# Altium project rtm-damp-dvb.PrjPcb (part 2 of 2)

## Sheet rtm-damp-dvb-clock-and-supply.SchDoc
size A4
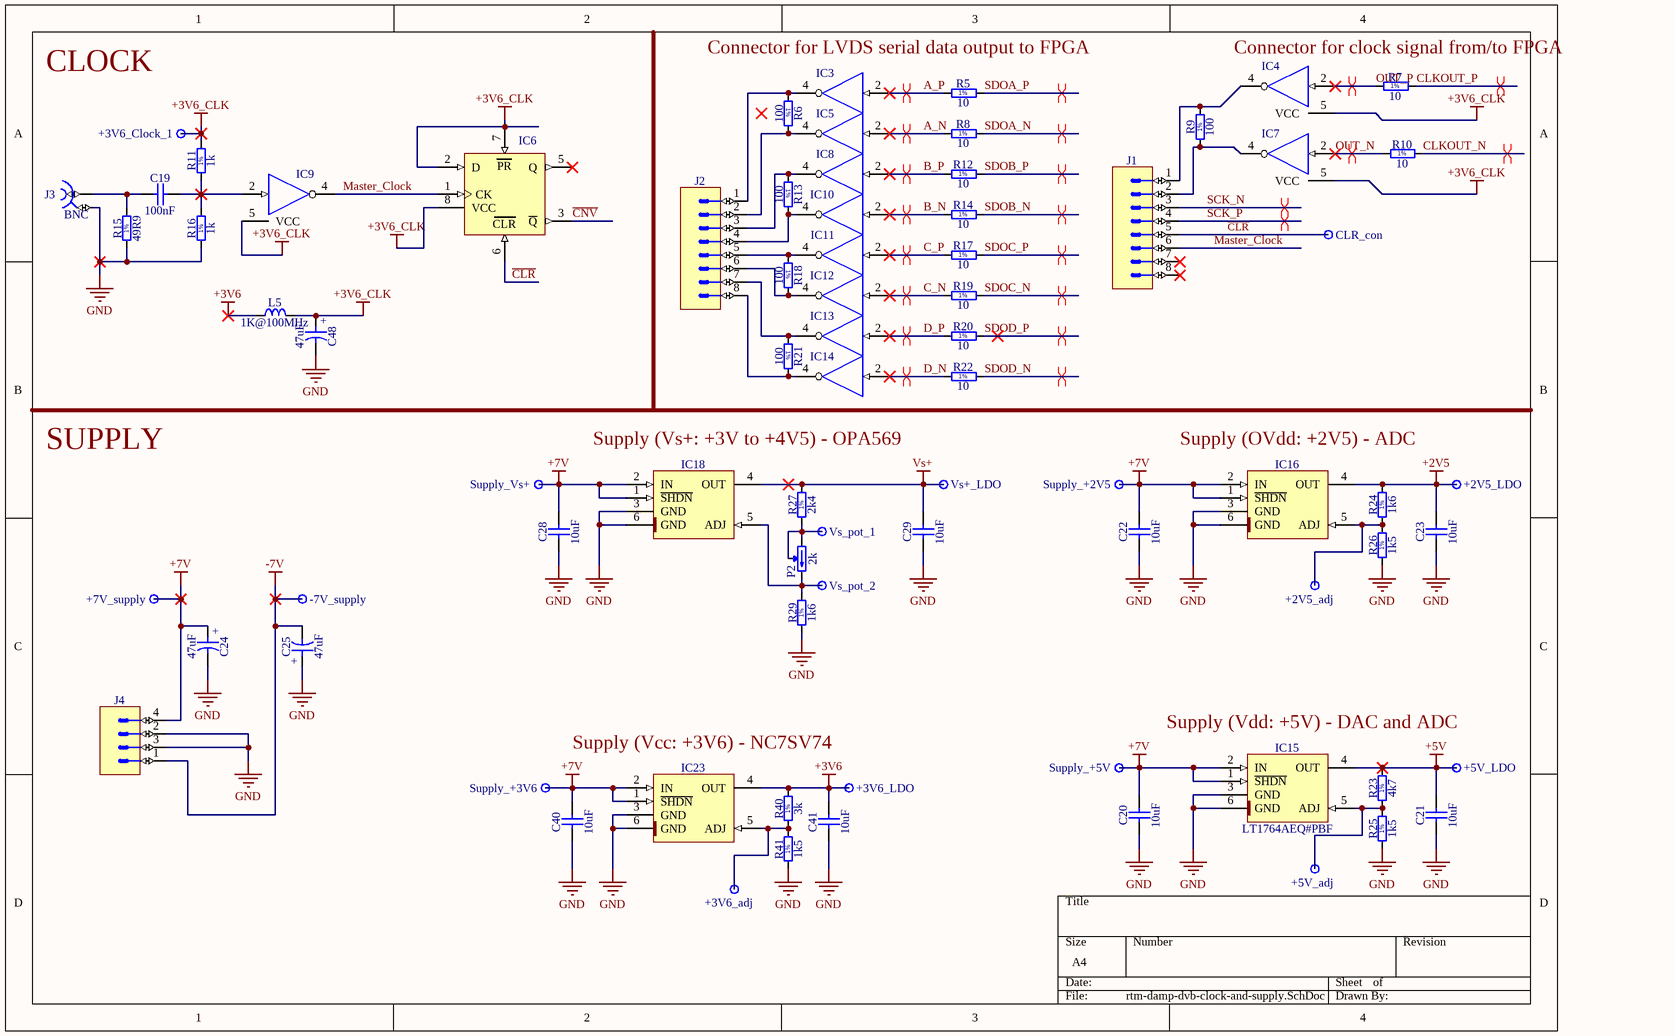
[diagram p2: rtm-damp-dvb-clock-and-supply.SchDoc]

### Parts
+2V5_adj  Test Point  [TPS127]  (value not drawn)
+2V5_LDO  Test Point  [TPS127]  (value not drawn)
+3V6_adj  Test Point  [TPS127]  (value not drawn)
+3V6_Clock_1  Test Point  [TPS127]  (value not drawn)
+3V6_LDO  Test Point  [TPS127]  (value not drawn)
+5V_adj  Test Point  [TPS127]  (value not drawn)
+5V_LDO  Test Point  [TPS127]  (value not drawn)
+7V_supply  Test Point  [TPS127]  (value not drawn)
-7V_supply  Test Point  [TPS127]  (value not drawn)
C19  100nF  [CAPC2012X135N]
C20  10uF  [CAPC3216X180N]
C21  10uF  [CAPC3216X180N]
C22  10uF  [CAPC3216X180N]
C23  10uF  [CAPC3216X180N]
C24  47uF  [CAPMP3528X210N]
C25  47uF  [CAPMP3528X210N]
C28  10uF  [CAPC3216X180N]
C29  10uF  [CAPC3216X180N]
C40  10uF  [CAPC3216X180N]
C41  10uF  [CAPC3216X180N]
C48  47uF  [CAPMP3528X210N]
CLR_con  Test Point  [TPS127]  (value not drawn)
IC3  NC7SVU04P5X  [SOT65P210X110-5N]  (value not drawn)
IC4  NC7SVU04P5X  [SOT65P210X110-5N]  (value not drawn)
IC5  NC7SVU04P5X  [SOT65P210X110-5N]  (value not drawn)
IC6  NC7SV74K8X  [SOP50P310X90-8N]  (value not drawn)
IC7  NC7SVU04P5X  [SOT65P210X110-5N]  (value not drawn)
IC8  NC7SVU04P5X  [SOT65P210X110-5N]  (value not drawn)
IC9  NC7SVU04P5X  [SOT65P210X110-5N]  (value not drawn)
IC10  NC7SVU04P5X  [SOT65P210X110-5N]  (value not drawn)
IC11  NC7SVU04P5X  [SOT65P210X110-5N]  (value not drawn)
IC12  NC7SVU04P5X  [SOT65P210X110-5N]  (value not drawn)
IC13  NC7SVU04P5X  [SOT65P210X110-5N]  (value not drawn)
IC14  NC7SVU04P5X  [SOT65P210X110-5N]  (value not drawn)
IC15  LT1764AEQ#PBF  [TO170P1394X457-6N-R900X1060]
IC16  LT1764AEQ#PBF  [TO170P1394X457-6N-R900X1060]  (value not drawn)
IC18  LT1764AEQ#PBF  [TO170P1394X457-6N-R900X1060]  (value not drawn)
IC23  LT1764AEQ#PBF  [TO170P1394X457-6N-R900X1060]  (value not drawn)
J1  Header 8  [SAMTEC_TSW-108-07-L-S-LL]  (value not drawn)
J2  Header 8  [SAMTEC_TSW-108-07-L-S-LL]  (value not drawn)
J3  BNC  [TYCO_1-1337542-0_a]
J4  KK®  [MOLEX_22-27-2041]  (value not drawn)
L5  1K@100MHz  [INDC1608X95N]
P2  2k  [TRIM_BOURNS_3223W]
R5  10  [RESC1608X55N]
R6  100  [RESC1608X55N]
R7  10  [RESC1608X55N]
R8  10  [RESC1608X55N]
R9  100  [RESC1608X55N]
R10  10  [RESC1608X55N]
R11  1k  [RESC1608X55N]
R12  10  [RESC1608X55N]
R13  100  [RESC1608X55N]
R14  10  [RESC1608X55N]
R15  49R9  [RESC1005X40N]
R16  1k  [RESC1608X55N]
R17  10  [RESC1608X55N]
R18  100  [RESC1608X55N]
R19  10  [RESC1608X55N]
R20  10  [RESC1608X55N]
R21  100  [RESC1608X55N]
R22  10  [RESC1608X55N]
R23  4k7  [RESC2012X60N]
R24  1k6  [RESC2012X60N]
R25  1k5  [RESC2012X60N]
R26  1k5  [RESC2012X60N]
R27  2k4  [RESC1608X55N]
R29  1k6  [RESC1608X55N]
R40  3k  [RESC1608X55N]
R41  1k5  [RESC2012X60N]
Supply_+2V5  Test Point  [TPS127]  (value not drawn)
Supply_+3V6  Test Point  [TPS127]  (value not drawn)
Supply_+5V  Test Point  [TPS127]  (value not drawn)
Supply_Vs+  Test Point  [TPS127]  (value not drawn)
Vs+_LDO  Test Point  [TPS127]  (value not drawn)
Vs_pot_1  Test Point  [TPS127]  (value not drawn)
Vs_pot_2  Test Point  [TPS127]  (value not drawn)

### Nets
+2V5: +2V5_LDO.1 C23.2 IC16.4(OUT) R24.2
+3V6: +3V6_LDO.1 C41.2 IC3.5(VCC) IC5.5(VCC) IC8.5(VCC) IC10.5(VCC) IC11.5(VCC) IC12.5(VCC) IC13.5(VCC) IC14.5(VCC) IC23.4(OUT) L5.1 R40.2
+3V6_CLK: +3V6_Clock_1.1 C48.1 IC4.5(VCC) IC6.2(D) IC6.7(~{PR}) IC6.8(VCC) IC7.5(VCC) IC9.5(VCC) L5.2 R11.2
+5V: +5V_LDO.1 C21.2 IC15.4(OUT) R23.2
+7V: +7V_supply.1 C20.2 C22.2 C24.1 C28.2 C40.2 IC15.1(~{SHDN}) IC15.2(IN) IC16.1(~{SHDN}) IC16.2(IN) IC18.1(~{SHDN}) IC18.2(IN) IC23.1(~{SHDN}) IC23.2(IN) J4.4 Supply_+2V5.1 Supply_+3V6.1 Supply_+5V.1 Supply_Vs+.1
-7V: -7V_supply.1 C25.2 J4.1
GND: C20.1 C21.1 C22.1 C23.1 C24.2 C25.1 C28.1 C29.1 C40.1 C41.1 C48.2 IC3.3(GND) IC4.3(GND) IC5.3(GND) IC6.4(GND) IC7.3(GND) IC8.3(GND) IC9.3(GND) IC10.3(GND) IC11.3(GND) IC12.3(GND) IC13.3(GND) IC14.3(GND) IC15.3(GND) IC15.6(GND) IC16.3(GND) IC16.6(GND) IC18.3(GND) IC18.6(GND) IC23.3(GND) IC23.6(GND) J3.2 J4.2 J4.3 R15.1 R16.1 R25.1 R26.1 R29.1 R41.1
Vs+: C29.2 IC18.4(OUT) R27.2 Vs+_LDO.1
A_N: IC5.2(IN) R8.1
A_P: IC3.2(IN) R5.1
B_N: IC10.2(IN) R14.1
B_P: IC8.2(IN) R12.1
~{CLR}: CLR_con.1 IC6.6(~{CLR}) J1.5
~{CNV}: IC6.3(~{Q})
C_N: IC12.2(IN) R19.1
C_P: IC11.2(IN) R17.1
CLKOUT_N: R10.2
CLKOUT_P: R7.2
D_N: IC14.2(IN) R22.1
D_P: IC13.2(IN) R20.1
Master_Clock: IC6.1(CK) IC9.4(OUT) J1.6
OUT_N: IC7.2(IN) R10.1
OUT_P: IC4.2(IN) R7.1
SCK_N: J1.3
SCK_P: J1.4
SDOA_N: R8.2
SDOA_P: R5.2
SDOB_N: R14.2
SDOB_P: R12.2
SDOC_N: R19.2
SDOC_P: R17.2
SDOD_N: R22.2
SDOD_P: R20.2
Net+2V5_adj_1: +2V5_adj.1 IC16.5(ADJ) R24.1 R26.2
Net+3V6_adj_1: +3V6_adj.1 IC23.5(ADJ) R40.1 R41.2
Net+5V_adj_1: +5V_adj.1 IC15.5(ADJ) R23.1 R25.2
NetC19_1: C19.1 J3.1 R15.2
NetC19_2: C19.2 IC9.2(IN) R11.1 R16.2
NetIC3_4: IC3.4(OUT) J2.1 R6.1
NetIC4_4: IC4.4(OUT) J1.1 R9.2
NetIC5_4: IC5.4(OUT) J2.2 R6.2
NetIC7_4: IC7.4(OUT) J1.2 R9.1
NetIC8_4: IC8.4(OUT) J2.3 R13.1
NetIC10_4: IC10.4(OUT) J2.4 R13.2
NetIC11_4: IC11.4(OUT) J2.5 R18.1
NetIC12_4: IC12.4(OUT) J2.6 R18.2
NetIC13_4: IC13.4(OUT) J2.7 R21.1
NetIC14_4: IC14.4(OUT) J2.8 R21.2
NetIC18_5: IC18.5(ADJ) P2.3(CW) R29.2 Vs_pot_2.1
NetP2_1: P2.1(CCW) P2.2(W) R27.1 Vs_pot_1.1

Not connected (* = marked no-connect by the designer): IC6 5(Q)*; J1 7* 8*

### Layout directives
differential pair: A_N, A_P, B_N, B_P, C_N, C_P, CLKOUT_N, CLKOUT_P, D_N, D_P, OUT_N, OUT_P, SCK_N, SCK_P, SDOA_N, SDOA_P, SDOB_N, SDOB_P, SDOC_N, SDOC_P, SDOD_N, SDOD_P

### Notes on the sheet
- CLOCK
- Connector for LVDS serial data output to FPGA
- Connector for clock signal from/to FPGA
- Supply (Vs+: +3V to +4V5) - OPA569
- Supply (OVdd: +2V5) - ADC
- SUPPLY
- Supply (Vcc: +3V6) - NC7SV74
- Supply (Vdd: +5V) - DAC and ADC
- (in symbol CTE3528-21_47UF_6.3V_10%_LESR0250) +
- (in symbol NC7SV74K8X) PR; CLR
- (in symbol R0402_49R9_1%_0.0625W_100PPM) 1%
- (in symbol R0603_1K6_1%_0.1W_100PPM) 1%
- (in symbol R0603_1K_1%_0.1W_100PPM) 1%
- (in symbol R0603_2K4_1%_0.1W_100PPM) 1%
- (in symbol R0603_3K_1%_0.1W_100PPM) 1%
- (in symbol R0603_10R_1%_0.1W_200PPM) 1%
- (in symbol R0603_100R_1%_0.1W_100PPM) 1%
- (in symbol R0805_1K5_1%_0.125W_100PPM) 1%
- (in symbol R0805_1K6_1%_0.125W_100PPM) 1%
- (in symbol R0805_4K7_1%_0.125W_100PPM) 1%

### Library data of the parts
+2V5_adj +2V5_LDO +3V6_adj +3V6_Clock_1 +3V6_LDO +5V_adj +5V_LDO +7V_supply -7V_supply CLR_con Supply_+2V5 Supply_+3V6 Supply_+5V Supply_Vs+ Vs+_LDO Vs_pot_1 Vs_pot_2 = SMD_PAD_1.27X1.27MM: Part Description: 1.27mm x 1.27mm PCB Copper Area (SMD Test Point); Mounted: No; Part Number: SMD_PAD_1.27X1.27MM; Component Kind: Standard (No BOM); Component Type: Standard (No BOM); Pin Count: 1; Family: Test Point; Socket: No; SMD: Yes; Sense: No; Status: None; ComponentHeight: 0mm; HelpURL: Undefined; Author: CERN DEM JLC; CreateDate: 12/01/2008; LatestRevisionDate: 12/01/2008; PackageDescription: 1.27mm x 1.27mm PCB Copper Area (SMD Test Point)
C19 = CC0805_100NF_50V_10%_X7R: Non-polarised capacitor; Part Description: SMD Multilayer Chip Ceramic Capacitor; Manufacturer: GENERIC; Manufacturer1 Part Number: C2012X7R1H104K085AA; Voltage: 50V; TC: X7R; Tolerance: ±10%; Part Number: CC0805_100NF_50V_10%_X7R; Component Kind: Standard; Component Type: Standard; Pin Count: 2; Value: 100nF; Status: Preferred; Manufacturer Part Number: CC0805_100NF_50V_10%_X7R; Case: 0805; Mounted: Yes; Socket: No; SMD: Yes; Sense: No; Manufacturer1 Example: TDK; Manufacturer1 ComponentHeight: 1mm; HelpURL: \\cern.ch\dfs\Applications\Altium\Datasheets\CC0805_X7R_TDK_C.pdf; Author: CERN DEM JLC; CreateDate: 03/12/2007; LatestRevisionDate: 22/04/2015
C20-C23 C28 C29 C40 C41 = CC1206_10UF_25V_10%_X7R: Non-polarised capacitor; Part Description: SMD Multilayer Chip Ceramic Capacitor; Manufacturer: GENERIC; Manufacturer1 Part Number: C1206C106K4RACTU; Voltage: 25V; TC: X7R; Tolerance: ±10%; Part Number: CC1206_10UF_25V_10%_X7R; Component Kind: Standard; Component Type: Standard; Pin Count: 2; Value: 10uF; Status: Preferred; Manufacturer Part Number: CC1206_10uF_25V_10%_X7R; Case: 1206; Mounted: Yes; Socket: No; SMD: Yes; Sense: No; Manufacturer1 Example: KEMET; Manufacturer1 ComponentHeight: 1.8mm; HelpURL: \\cern.ch\dfs\Applications\Altium\Datasheets\CC1206_X7R_KEMET.pdf; Author: CERN DEM JLC; CreateDate: 12/09/2012; LatestRevisionDate: 12/09/2012
C24 C25 C48 = CTE3528-21_47UF_6.3V_10%_LESR0250: Polarised capacitor; Part Description: Low ESR 0R25 Solid Tantalum Chip Capacitor; Manufacturer: GENERIC; Manufacturer1 Part Number: TPSB476K006R0250; Voltage: 6.3V; Tolerance: ±10%; Part Number: CTE3528-21_47UF_6.3V_10%_LESR0250; Component Kind: Standard; Component Type: Standard; Pin Count: 2; Value: 47uF; Status: Preferred; Manufacturer Part Number: CTE3528-21_47UF_6.3V_10%_LESR0250; Case: B; Mounted: Yes; Socket: No; SMD: Yes; Sense: No; Manufacturer1 Example: AVX; Manufacturer1 ComponentHeight: 2.1mm; HelpURL: \\cern.ch\dfs\Applications\Altium\Datasheets\CTE-LESR_AVX_TPS.pdf; Author: CERN DEM JLC; CreateDate: 05/05/2008; LatestRevisionDate: 20/01/2009
IC3-IC5 IC7-IC14 = NC7SVU04P5X: TinyLogic® HS Inverter (Open Drain Output); Part Description: TinyLogic® ULP-A Unbuffered Inverter; Manufacturer: FAIRCHILD SEMICONDUCTOR; Manufacturer Part Number: git pu; PressFit: No; Bonding: No; Part Number: NC7SVU04P5X; Component Kind: Standard; Component Type: Standard; Device: NC7SVU04P5X; PackageDescription: SOT353, SC70-5, SOT, 0.65mm Pitch, 5 pin, 1.25mm W X 2.00mm L X 1.10mm H, IPC Medium Density; Pin Count: 5; Case: SOT353; Mounted: Yes; Socket: No; SMD: Yes; Sense: No; ComponentHeight: 1.1mm; Author: LNLS DIG LOS; CreateDate: 06/06/2018; LatestRevisionDate: 06/06/2018
IC6 = NC7SV74K8X: TinyLogic® UHS D-Type Flip-Flop With Preset And Clear; Part Description: TinyLogic® ULP-A D-Type Flip-Flop with Preset and Clear; Manufacturer: FAIRCHILD SEMICONDUCTOR; PressFit: No; Bonding: No; Part Number: NC7SV74K8X; Component Kind: Standard; Component Type: Standard; Device: NC7SV74K8X; PackageDescription: SOP, 0.50mm pitch; 8 pin, 2.30mm W X 2.00mm L X 0.90mm H body, PC Medium Density; Manufacturer Part Number: NC7SV74K8X; Pin Count: 8; Case: TSSOP8; Mounted: Yes; Socket: No; SMD: Yes; Sense: No; ComponentHeight: 0.9mm; Author: LNLS DIG LOS; CreateDate: 06/06/2018; LatestRevisionDate: 06/06/2018
IC15 IC16 IC18 IC23 = LT1764AEQ#PBF: 3A, Fast Transient Response, Low Noise, LDO Regulators; Part Description: 2.5V 3A, Fast Transient Response, Low Noise, LDO Regulators; Manufacturer: LINEAR TECHNOLOGY; PressFit: No; Bonding: No; Part Number: LT1764AEQ#PBF; Component Kind: Standard; Component Type: Standard; Device: LT1764AEQ#PBF; PackageDescription: TO, 1.70mm Pitch; 5 Pin, 13.945mm L X 8.89mm W X 4.572mm H body, IPC Medium Density; Manufacturer Part Number: LT1764AEQ#PBF; Pin Count: 6; Case: TO-263; Mounted: Yes; Socket: No; SMD: Yes; Sense: No; ComponentHeight: 4.57mm; Author: LNLS DIG GBMB; CreateDate: 17/02/2017; LatestRevisionDate: 17/02/2017
J1 J2 = SAMTEC_TSW-108-07-L-S-LL: Connector 8 Male; Part Description: 8 Contacts - Pitch 2.54mm - Single Row  Through Mount Straigh Header (Post Lead 5.84mm, Tail Lead 2.54mm, Insulator 2.54mm); Manufacturer: SAMTEC; PressFit: No; Part Number: SAMTEC_TSW-108-07-L-S-LL; Component Kind: Standard; Component Type: Standard; Pin Count: 8; Family: Header 8; Mounted: Yes; Socket: No; Sense: No; SMD: No; Status: None; Manufacturer Part Number: TSW-108-07-L-S-LL; ComponentHeight: 8.38mm; HelpURL: \\cern.ch\dfs\Applications\Altium\Datasheets\SAMTEC_TSW-108-07-L-S-LL.pdf; Author: CERN DEM MR; CreateDate: 15/07/2016; LatestRevisionDate: 15/07/2016
J3 = TYCO_1-1337542-0_a: Part Description: 50 Ohms  BNC Elbow PCB Socket With Mounting Posts + Mount Nut + Lockwasher; Manufacturer: TYCO ELECTRONICS; Manufacturer Part Number: 1-1337542-0 + 1-1634816-0 + 1-1634817-0; PressFit: No; Part Number: TYCO_1-1337542-0_a; Component Kind: Standard; Component Type: Standard; Pin Count: 2; Family: BNC; Mounted: Yes; Socket: No; SMD: No; Sense: No; Status: None; ComponentHeight: 14.93mm; HelpURL: \\cern.ch\dfs\Applications\Altium\Datasheets\TYCO_1-1337542-0.pdf; Author: CERN DEM JLC; CreateDate: 02/02/2012; LatestRevisionDate: 02/02/2012
J4 = MOLEX_22-27-2041: Connector 4 Male; Part Description: 2.54mm (.100") Pitch KK® Wire-to-Board Header, Vertical, with Friction Lock, 4 Circuits, Tin (Sn) Plating; Manufacturer: MOLEX; PressFit: No; Part Number: MOLEX_22-27-2041; Component Kind: Standard; Component Type: Standard; Pin Count: 4; Family: KK®; Mounted: Yes; Socket: No; SMD: No; Sense: No; Status: None; Manufacturer Part Number: 22-27-2041; ComponentHeight: 11.7mm; HelpURL: \\cern.ch\dfs\Applications\Altium\Datasheets\MOLEX_22-27-2041.pdf; Author: CERN DEM JLC; CreateDate: 04/12/2008; LatestRevisionDate: 04/12/2008
L5 = IND0603_MURATA_BLM18AG102SN1D: Inductor; Part Description: SMD EMIFIL Suppression Chip Ferrite Bead; Manufacturer: MURATA; Power: 400mA; Resistance: 0.50R; Tolerance: ±25%; Part Number: IND0603_MURATA_BLM18AG102SN1D; Component Kind: Standard; Component Type: Standard; Pin Count: 2; Value: 1K@100MHz; Status: None; Manufacturer Part Number: BLM18AG102SN1D; Case: 0603; Mounted: Yes; Socket: No; SMD: Yes; Sense: No; ComponentHeight: 0.95mm; Author: LNLS DIG GBMB; CreateDate: 03/11/2017; LatestRevisionDate: 03/11/2017
P2 = TRIM_11T_2K_BOURNS_3223W-1-202E: Trimming Potentiometer; Part Description: 11 Turns SMD Trimpot® Trimming Potentiometer (Top Adjust); Manufacturer: BOURNS; Power: 0.125W; TC: ±100ppm/°C; Tolerance: ±20%; Part Number: TRIM_11T_2K_BOURNS_3223W-1-202E; Component Kind: Standard; Component Type: Standard; Pin Count: 3; Value: 2k; Manufacturer Part Number: 3223W-1-202E; Case: 3223W; Mounted: Yes; Socket: No; SMD: Yes; Sense: No; ComponentHeight: 4.16mm; HelpURL: \\cern.ch\dfs\Applications\Altium\Datasheets\TRIM_BOURNS_3223W.pdf; Author: CERN DEM JLC; CreateDate: 31/03/2011; LatestRevisionDate: 18/12/2012
R5 R7 R8 R10 R12 R14 R17 R19 R20 R22 = R0603_10R_1%_0.1W_200PPM: Resistor - 1%; Part Description: General Purpose Thick Film Chip Resistor; Manufacturer: GENERIC; Manufacturer1 Part Number: NRC06F10R0TRF; Power: 0.1W; TC: ±200ppm/°C; Part Number: R0603_10R_1%_0.1W_200PPM; Component Kind: Standard; Component Type: Standard; Pin Count: 2; Value: 10; Status: Preferred; Tolerance: ±1%; Manufacturer Part Number: R0603_10R_1%_0.1W_200PPM; Case: 0603; Mounted: Yes; Sense: No; Socket: No; SMD: Yes; Manufacturer1 Example: NIC COMPONENT; Manufacturer1 ComponentHeight: 0.55mm; HelpURL: \\cern.ch\dfs\Applications\Altium\Datasheets\R0603_NIC_NRC.pdf; Author: CERN DEM JLC; CreateDate: 03/12/2007; LatestRevisionDate: 24/06/2009
R6 R9 R13 R18 R21 = R0603_100R_1%_0.1W_100PPM: Resistor - 1%; Part Description: General Purpose Thick Film Chip Resistor; Manufacturer: GENERIC; Manufacturer1 Part Number: NRC06F1000TRF; Power: 0.1W; TC: ±100ppm/°C; Part Number: R0603_100R_1%_0.1W_100PPM; Component Kind: Standard; Component Type: Standard; Pin Count: 2; Value: 100; Status: Preferred; Tolerance: ±1%; Manufacturer Part Number: R0603_100R_1%_0.1W_100PPM; Case: 0603; Mounted: Yes; Sense: No; Socket: No; SMD: Yes; Manufacturer1 Example: NIC COMPONENT; Manufacturer1 ComponentHeight: 0.55mm; HelpURL: \\cern.ch\dfs\Applications\Altium\Datasheets\R0603_NIC_NRC.pdf; Author: CERN DEM JLC; CreateDate: 03/12/2007; LatestRevisionDate: 13/03/2008
R11 R16 = R0603_1K_1%_0.1W_100PPM: Resistor - 1%; Part Description: General Purpose Thick Film Chip Resistor; Manufacturer: GENERIC; Manufacturer1 Part Number: NRC06F1001TRF; Power: 0.1W; TC: ±100ppm/°C; Part Number: R0603_1K_1%_0.1W_100PPM; Component Kind: Standard; Component Type: Standard; Pin Count: 2; Value: 1k; Status: Preferred; Tolerance: ±1%; Manufacturer Part Number: R0603_1K_1%_0.1W_100PPM; Case: 0603; Mounted: Yes; Sense: No; Socket: No; SMD: Yes; Manufacturer1 Example: NIC COMPONENT; Manufacturer1 ComponentHeight: 0.55mm; HelpURL: \\cern.ch\dfs\Applications\Altium\Datasheets\R0603_NIC_NRC.pdf; Author: CERN DEM JLC; CreateDate: 03/12/2007; LatestRevisionDate: 13/03/2008
R15 = R0402_49R9_1%_0.0625W_100PPM: Resistor - 1%; Part Description: General Purpose Thick Film Chip Resistor; Manufacturer: GENERIC; Manufacturer1 Part Number: 232270674999L or RC0402FR-0749R9L; TC: ±100ppm/°C; Part Number: R0402_49R9_1%_0.0625W_100PPM; Component Kind: Standard; Component Type: Standard; Pin Count: 2; Value: 49R9; Status: Not recommended; Power: 0.0625W; Tolerance: ±1%; Manufacturer Part Number: R0402_49R9_1%_0.0625W_100PPM; Case: 0402; Mounted: Yes; Sense: No; Socket: No; SMD: Yes; Manufacturer1 Example: YAGEO PHYCOMP; Manufacturer1 ComponentHeight: 0.4mm; HelpURL: \\cern.ch\dfs\Applications\Altium\Datasheets\R0402_Phycomp_RC0402.pdf; Author: CERN DEM JLC; CreateDate: 24/10/2012; LatestRevisionDate: 24/10/2012
R23 = R0805_4K7_1%_0.125W_100PPM: Resistor - 1%; Part Description: General Purpose Thick Film Chip Resistor; Manufacturer: GENERIC; Manufacturer1 Part Number: NRC10F4701TRF; Power: 0.125W; TC: ±100ppm/°C; Part Number: R0805_4K7_1%_0.125W_100PPM; Component Kind: Standard; Component Type: Standard; Pin Count: 2; Value: 4k7; Status: Preferred; Tolerance: ±1%; Manufacturer Part Number: R0805_4K7_1%_0.125W_100PPM; Case: 0805; Mounted: Yes; Sense: No; Socket: No; SMD: Yes; Manufacturer1 Example: NIC COMPONENT; Manufacturer1 ComponentHeight: 0.6mm; HelpURL: \\cern.ch\dfs\Applications\Altium\Datasheets\R0805_NIC_NRC.pdf; Author: CERN DEM JLC; CreateDate: 03/12/2007; LatestRevisionDate: 13/03/2008
R24 = R0805_1K6_1%_0.125W_100PPM: Resistor - 1%; Part Description: General Purpose Thick Film Chip Resistor; Manufacturer: GENERIC; Manufacturer1 Part Number: NRC10F1601TRF; Power: 0.125W; TC: ±100ppm/°C; Part Number: R0805_1K6_1%_0.125W_100PPM; Component Kind: Standard; Component Type: Standard; Pin Count: 2; Value: 1k6; Status: Preferred; Tolerance: ±1%; Manufacturer Part Number: R0805_1K6_1%_0.125W_100PPM; Case: 0805; Mounted: Yes; Sense: No; Socket: No; SMD: Yes; Manufacturer1 Example: NIC COMPONENT; Manufacturer1 ComponentHeight: 0.6mm; HelpURL: \\cern.ch\dfs\Applications\Altium\Datasheets\R0805_NIC_NRC.pdf; Author: CERN DEM JLC; CreateDate: 03/12/2007; LatestRevisionDate: 13/03/2008
R25 R26 R41 = R0805_1K5_1%_0.125W_100PPM: Resistor - 1%; Part Description: General Purpose Thick Film Chip Resistor; Manufacturer: GENERIC; Manufacturer1 Part Number: NRC10F1501TRF; Power: 0.125W; TC: ±100ppm/°C; Part Number: R0805_1K5_1%_0.125W_100PPM; Component Kind: Standard; Component Type: Standard; Pin Count: 2; Value: 1k5; Status: Preferred; Tolerance: ±1%; Manufacturer Part Number: R0805_1K5_1%_0.125W_100PPM; Case: 0805; Mounted: Yes; Sense: No; Socket: No; SMD: Yes; Manufacturer1 Example: NIC COMPONENT; Manufacturer1 ComponentHeight: 0.6mm; HelpURL: \\cern.ch\dfs\Applications\Altium\Datasheets\R0805_NIC_NRC.pdf; Author: CERN DEM JLC; CreateDate: 03/12/2007; LatestRevisionDate: 13/03/2008
R27 = R0603_2K4_1%_0.1W_100PPM: Resistor - 1%; Part Description: General Purpose Thick Film Chip Resistor; Manufacturer: GENERIC; Manufacturer1 Part Number: NRC06F2401TRF; Power: 0.1W; TC: ±100ppm/°C; Part Number: R0603_2K4_1%_0.1W_100PPM; Component Kind: Standard; Component Type: Standard; Pin Count: 2; Value: 2k4; Status: Preferred; Tolerance: ±1%; Manufacturer Part Number: R0603_2K4_1%_0.1W_100PPM; Case: 0603; Mounted: Yes; Sense: No; Socket: No; SMD: Yes; Manufacturer1 Example: NIC COMPONENT; Manufacturer1 ComponentHeight: 0.55mm; HelpURL: \\cern.ch\dfs\Applications\Altium\Datasheets\R0603_NIC_NRC.pdf; Author: CERN DEM JLC; CreateDate: 03/12/2007; LatestRevisionDate: 13/03/2008
R29 = R0603_1K6_1%_0.1W_100PPM: Resistor - 1%; Part Description: General Purpose Thick Film Chip Resistor; Manufacturer: GENERIC; Manufacturer1 Part Number: NRC06F1601TRF; Power: 0.1W; TC: ±100ppm/°C; Part Number: R0603_1K6_1%_0.1W_100PPM; Component Kind: Standard; Component Type: Standard; Pin Count: 2; Value: 1k6; Status: Preferred; Tolerance: ±1%; Manufacturer Part Number: R0603_1K6_1%_0.1W_100PPM; Case: 0603; Mounted: Yes; Sense: No; Socket: No; SMD: Yes; Manufacturer1 Example: NIC COMPONENT; Manufacturer1 ComponentHeight: 0.55mm; HelpURL: \\cern.ch\dfs\Applications\Altium\Datasheets\R0603_NIC_NRC.pdf; Author: CERN DEM JLC; CreateDate: 03/12/2007; LatestRevisionDate: 13/03/2008
R40 = R0603_3K_1%_0.1W_100PPM: Resistor - 1%; Part Description: General Purpose Thick Film Chip Resistor; Manufacturer: GENERIC; Manufacturer1 Part Number: NRC06F3001TRF; Power: 0.1W; TC: ±100ppm/°C; Part Number: R0603_3K_1%_0.1W_100PPM; Component Kind: Standard; Component Type: Standard; Pin Count: 2; Value: 3k; Status: Preferred; Tolerance: ±1%; Manufacturer Part Number: R0603_3K_1%_0.1W_100PPM; Case: 0603; Mounted: Yes; Sense: No; Socket: No; SMD: Yes; Manufacturer1 Example: NIC COMPONENT; Manufacturer1 ComponentHeight: 0.55mm; HelpURL: \\cern.ch\dfs\Applications\Altium\Datasheets\R0603_NIC_NRC.pdf; Author: CERN DEM JLC; CreateDate: 03/12/2007; LatestRevisionDate: 13/03/2008

## Nets that join several sheets
+2V5: rtm-damp-dvb-ADC-circuit (L4.1), rtm-damp-dvb-clock-and-supply (+2V5_LDO.1 C23.2 IC16.4 R24.2)
+5V: rtm-damp-dvb (5 pins), rtm-damp-dvb-ADC-circuit (L3.1), rtm-damp-dvb-clock-and-supply (+5V_LDO.1 C21.2 IC15.4 R23.2)
+7V: rtm-damp-dvb (R28.2 Supply_Vref.1), rtm-damp-dvb-ADC-circuit (L1.1), rtm-damp-dvb-clock-and-supply (19 pins)
-7V: rtm-damp-dvb-ADC-circuit (L2.1), rtm-damp-dvb-clock-and-supply (-7V_supply.1 C25.2 J4.1)
GND: rtm-damp-dvb (52 pins), rtm-damp-dvb-ADC-circuit (38 pins), rtm-damp-dvb-clock-and-supply (40 pins)
Vs+: rtm-damp-dvb (L6.1), rtm-damp-dvb-clock-and-supply (C29.2 IC18.4 R27.2 Vs+_LDO.1)
~{CNV}: rtm-damp-dvb-ADC-circuit (CNV_ADC.1 IC1.24), rtm-damp-dvb-clock-and-supply (IC6.3)
CLKOUT_N: rtm-damp-dvb-ADC-circuit (IC1.34), rtm-damp-dvb-clock-and-supply (R10.2)
CLKOUT_P: rtm-damp-dvb-ADC-circuit (IC1.33), rtm-damp-dvb-clock-and-supply (R7.2)
SCK_N: rtm-damp-dvb-ADC-circuit (IC1.42 R4.2), rtm-damp-dvb-clock-and-supply (J1.3)
SCK_P: rtm-damp-dvb-ADC-circuit (IC1.41 R4.1), rtm-damp-dvb-clock-and-supply (J1.4)
SDOA_N: rtm-damp-dvb-ADC-circuit (IC1.28), rtm-damp-dvb-clock-and-supply (R8.2)
SDOA_P: rtm-damp-dvb-ADC-circuit (IC1.27), rtm-damp-dvb-clock-and-supply (R5.2)
SDOB_N: rtm-damp-dvb-ADC-circuit (IC1.30), rtm-damp-dvb-clock-and-supply (R14.2)
SDOB_P: rtm-damp-dvb-ADC-circuit (IC1.29), rtm-damp-dvb-clock-and-supply (R12.2)
SDOC_N: rtm-damp-dvb-ADC-circuit (IC1.36), rtm-damp-dvb-clock-and-supply (R19.2)
SDOC_P: rtm-damp-dvb-ADC-circuit (IC1.35), rtm-damp-dvb-clock-and-supply (R17.2)
SDOD_N: rtm-damp-dvb-ADC-circuit (IC1.40), rtm-damp-dvb-clock-and-supply (R22.2)
SDOD_P: rtm-damp-dvb-ADC-circuit (IC1.39), rtm-damp-dvb-clock-and-supply (R20.2)
Vshunt_N: rtm-damp-dvb (R31.V1), rtm-damp-dvb-ADC-circuit (IC2.1 Rshunt_2.1)
Vshunt_P: rtm-damp-dvb (R31.V2), rtm-damp-dvb-ADC-circuit (IC2.4 Rshunt_1.1)